# Altium schematic sheet 10_RFFE.SchDoc: RF front end
size A3; Organization: Lime Microsystems; Address1: Surrey Tech Centre; Address2: Guildford GU2 7YG; Address3: Surrey; Address4: United Kingdom; Revision: v1.0; SheetNumber: 10; SheetTotal: 12
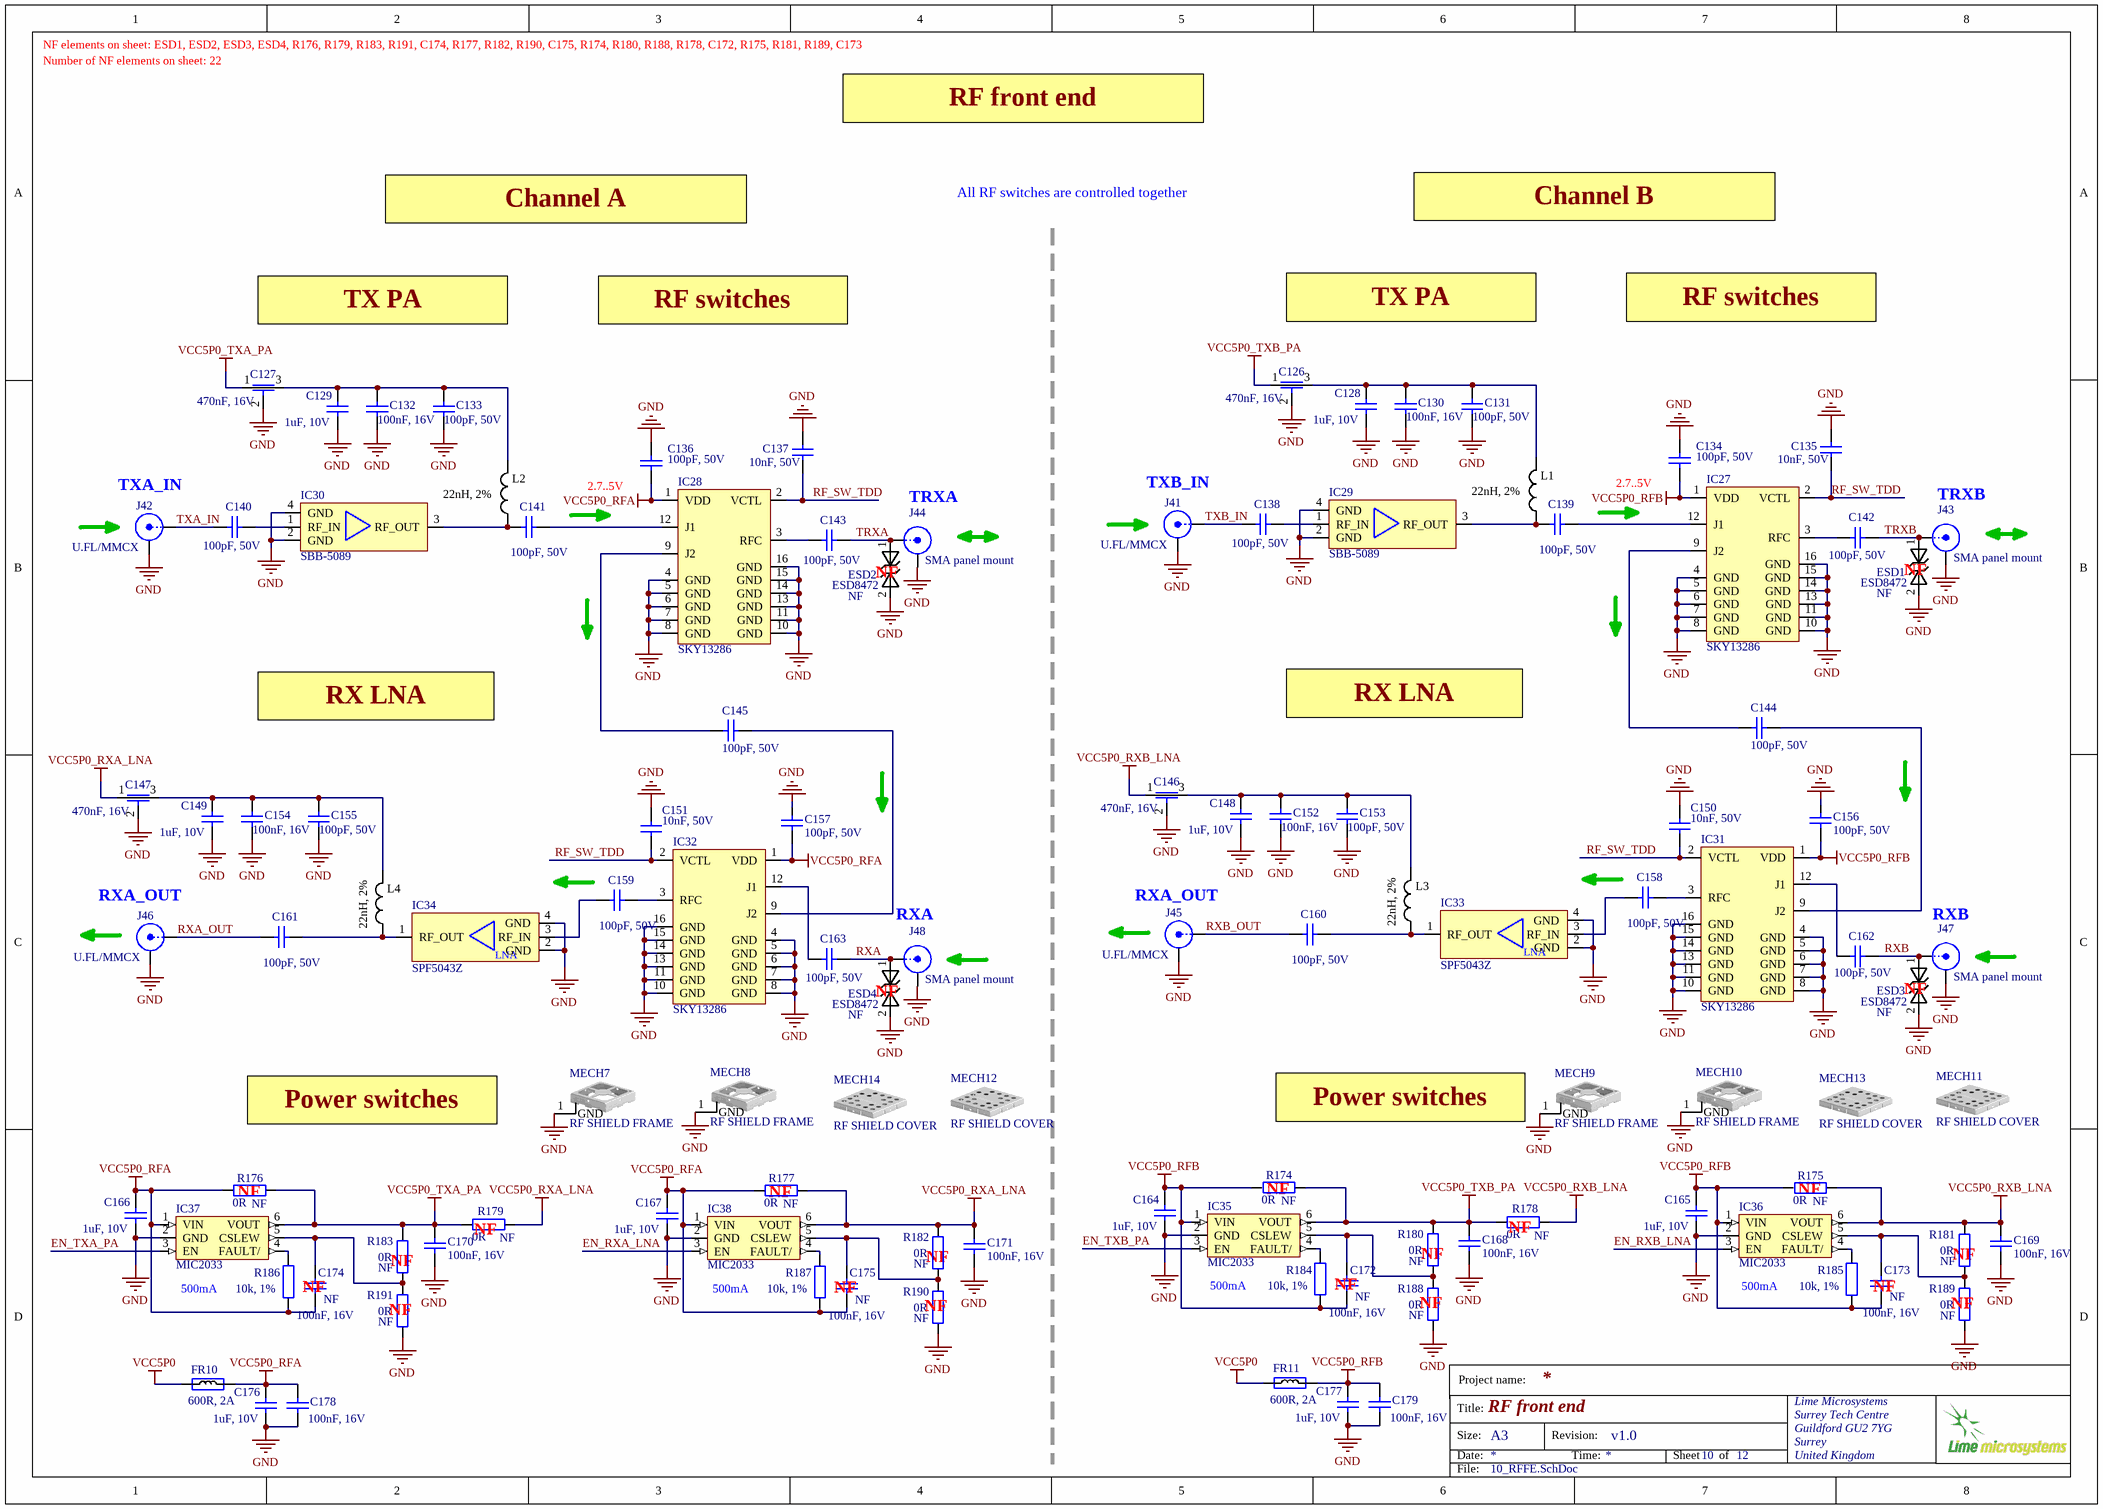
[diagram p0: 10_RFFE.SchDoc]

## Parts
C126  470nF, 16V  [CAP0805_FEEDTHROUGH]
C127  470nF, 16V  [CAP0805_FEEDTHROUGH]
C128  1uF, 10V  [CAP0402]
C129  1uF, 10V  [CAP0402]
C130  100nF, 16V  [CAP0402]
C131  100pF, 50V  [CAP0402]
C132  100nF, 16V  [CAP0402]
C133  100pF, 50V  [CAP0402]
C134  100pF, 50V  [CAP0402]
C135  10nF, 50V  [CAP0402]
C136  100pF, 50V  [CAP0402]
C137  10nF, 50V  [CAP0402]
C138  100pF, 50V  [CAP0402]
C139  100pF, 50V  [CAP0402]
C140  100pF, 50V  [CAP0402]
C141  100pF, 50V  [CAP0402]
C142  100pF, 50V  [CAP0402]
C143  100pF, 50V  [CAP0402]
C144  100pF, 50V  [CAP0402]
C145  100pF, 50V  [CAP0402]
C146  470nF, 16V  [CAP0805_FEEDTHROUGH]
C147  470nF, 16V  [CAP0805_FEEDTHROUGH]
C148  1uF, 10V  [CAP0402]
C149  1uF, 10V  [CAP0402]
C150  10nF, 50V  [CAP0402]
C151  10nF, 50V  [CAP0402]
C152  100nF, 16V  [CAP0402]
C153  100pF, 50V  [CAP0402]
C154  100nF, 16V  [CAP0402]
C155  100pF, 50V  [CAP0402]
C156  100pF, 50V  [CAP0402]
C157  100pF, 50V  [CAP0402]
C158  100pF, 50V  [CAP0402]
C159  100pF, 50V  [CAP0402]
C160  100pF, 50V  [CAP0402]
C161  100pF, 50V  [CAP0402]
C162  100pF, 50V  [CAP0402]
C163  100pF, 50V  [CAP0402]
C164  1uF, 10V  [CAP0402]
C165  1uF, 10V  [CAP0402]
C166  1uF, 10V  [CAP0402]
C167  1uF, 10V  [CAP0402]
C168  100nF, 16V  [CAP0402]
C169  100nF, 16V  [CAP0402]
C170  100nF, 16V  [CAP0402]
C171  100nF, 16V  [CAP0402]
C172  100nF, 16V  Assembly Info: NF  [CAP0402]
C173  100nF, 16V  Assembly Info: NF  [CAP0402]
C174  100nF, 16V  Assembly Info: NF  [CAP0402]
C175  100nF, 16V  Assembly Info: NF  [CAP0402]
C176  1uF, 10V  [CAP0402]
C177  1uF, 10V  [CAP0402]
C178  100nF, 16V  [CAP0402]
C179  100nF, 16V  [CAP0402]
ESD1  ESD8472  Assembly Info: NF  [ESD8472_X3DFN2]
ESD2  ESD8472  Assembly Info: NF  [ESD8472_X3DFN2]
ESD3  ESD8472  Assembly Info: NF  [ESD8472_X3DFN2]
ESD4  ESD8472  Assembly Info: NF  [ESD8472_X3DFN2]
FR10  600R, 2A  [RES0805]
FR11  600R, 2A  [RES0805]
IC27  SKY13286  [SKY13286-359LF_RF_switch_QFN16]
IC28  SKY13286  [SKY13286-359LF_RF_switch_QFN16]
IC29  SBB-5089  [SBB-5089_RF_AMP_SOT89]
IC30  SBB-5089  [SBB-5089_RF_AMP_SOT89]
IC31  SKY13286  [SKY13286-359LF_RF_switch_QFN16]
IC32  SKY13286  [SKY13286-359LF_RF_switch_QFN16]
IC33  SPF5043Z  [SPF5043Z_SOT-343]
IC34  SPF5043Z  [SPF5043Z_SOT-343]
IC35  MIC2033  [SOT23-6]
IC36  MIC2033  [SOT23-6]
IC37  MIC2033  [SOT23-6]
IC38  MIC2033  [SOT23-6]
J41  U.FL/MMCX  [MMCX_UFL_conn_u]
J42  U.FL/MMCX  [MMCX_UFL_conn_u]
J43  SMA panel mount  [SMA_connector_side]
J44  SMA panel mount  [SMA_connector_side]
J45  U.FL/MMCX  [MMCX_UFL_conn_u]
J46  U.FL/MMCX  [MMCX_UFL_conn_u]
J47  SMA panel mount  [SMA_connector_side]
J48  SMA panel mount  [SMA_connector_side]
L1  22nH, 2%  [RES0603]
L2  22nH, 2%  [RES0603]
L3  22nH, 2%  [RES0603]
L4  22nH, 2%  [RES0603]
MECH7  RF SHIELD FRAME  [RF_SHIELD_FRAME_16P5x16P5_2118716-2_v1]
MECH8  RF SHIELD FRAME  [RF_SHIELD_FRAME_16P5x16P5_2118716-2_v1]
MECH9  RF SHIELD FRAME  [RF_SHIELD_FRAME_16P5x16P5_2118716-2_v1]
MECH10  RF SHIELD FRAME  [RF_SHIELD_FRAME_16P5x16P5_2118716-2_v1]
MECH11  RF SHIELD COVER  [RF_SHIELD_COVER_16Px916P9_2118715-2]
MECH12  RF SHIELD COVER  [RF_SHIELD_COVER_16Px916P9_2118715-2]
MECH13  RF SHIELD COVER  [RF_SHIELD_COVER_16Px916P9_2118715-2]
MECH14  RF SHIELD COVER  [RF_SHIELD_COVER_16Px916P9_2118715-2]
R174  0R  Assembly Info: NF  [RES0402]
R175  0R  Assembly Info: NF  [RES0402]
R176  0R  Assembly Info: NF  [RES0402]
R177  0R  Assembly Info: NF  [RES0402]
R178  0R  Assembly Info: NF  [RES0805]
R179  0R  Assembly Info: NF  [RES0805]
R180  0R  Assembly Info: NF  [RES0402]
R181  0R  Assembly Info: NF  [RES0402]
R182  0R  Assembly Info: NF  [RES0402]
R183  0R  Assembly Info: NF  [RES0402]
R184  10k, 1%  [RES0402]
R185  10k, 1%  [RES0402]
R186  10k, 1%  [RES0402]
R187  10k, 1%  [RES0402]
R188  0R  Assembly Info: NF  [RES0402]
R189  0R  Assembly Info: NF  [RES0402]
R190  0R  Assembly Info: NF  [RES0402]
R191  0R  Assembly Info: NF  [RES0402]

## Nets
GND: C126.2 C127.2 C128.1 C129.1 C130.2 C131.1 C132.2 C133.1 C134.2 C135.1 C136.2 C137.1 C146.2 C147.2 C148.1 C149.1 C150.2 C151.2 C152.2 C153.1 C154.2 C155.1 C156.2 C157.2 C164.2 C165.2 C166.2 C167.2 C168.2 C169.2 C170.2 C171.2 C176.1 C177.1 C178.2 C179.2 ESD1.2 ESD2.2 ESD3.2 ESD4.2 IC27.4(GND) IC27.5(GND) IC27.6(GND) IC27.7(GND) IC27.8(GND) IC27.10(GND) IC27.11(GND) IC27.13(GND) IC27.14(GND) IC27.15(GND) IC27.16(GND) IC28.4(GND) IC28.5(GND) IC28.6(GND) IC28.7(GND) IC28.8(GND) IC28.10(GND) IC28.11(GND) IC28.13(GND) IC28.14(GND) IC28.15(GND) IC28.16(GND) IC29.2(GND) IC29.4(GND) IC30.2(GND) IC30.4(GND) IC31.4(GND) IC31.5(GND) IC31.6(GND) IC31.7(GND) IC31.8(GND) IC31.10(GND) IC31.11(GND) IC31.13(GND) IC31.14(GND) IC31.15(GND) IC31.16(GND) IC32.4(GND) IC32.5(GND) IC32.6(GND) IC32.7(GND) IC32.8(GND) IC32.10(GND) IC32.11(GND) IC32.13(GND) IC32.14(GND) IC32.15(GND) IC32.16(GND) IC33.2(GND) IC33.4(GND) IC34.2(GND) IC34.4(GND) IC35.2(GND) IC36.2(GND) IC37.2(GND) IC38.2(GND) J41.2(Y) J42.2(Y) J43.2(Y) J44.2(Y) J45.2(Y) J46.2(Y) J47.2(Y) J48.2(Y) MECH7.1(GND) MECH8.1(GND) MECH9.1(GND) MECH10.1(GND) R188.1 R189.1 R190.1 R191.1
VCC5P0: FR10.1 FR11.1
VCC5P0_RFA: C136.1 C157.1 C166.1 C167.1 C174.2 C175.2 C176.2 C178.1 FR10.2 IC28.1(VDD) IC32.1(VDD) IC37.1(VIN) IC38.1(VIN) R176.2 R177.2 R186.1 R187.1
VCC5P0_RFB: C134.1 C156.1 C164.1 C165.1 C172.2 C173.2 C177.2 C179.1 FR11.2 IC27.1(VDD) IC31.1(VDD) IC35.1(VIN) IC36.1(VIN) R174.2 R175.2 R184.1 R185.1
VCC5P0_RXA_LNA: C147.1 C171.1 IC38.6(VOUT) R177.1 R179.1 R182.2
VCC5P0_RXB_LNA: C146.1 C169.1 IC36.6(VOUT) R175.1 R178.1 R181.2
VCC5P0_TXA_PA: C127.1 C170.1 IC37.6(VOUT) R176.1 R179.2 R183.2
VCC5P0_TXB_PA: C126.1 C168.1 IC35.6(VOUT) R174.1 R178.2 R180.2
EN_RXA_LNA: IC38.3(EN)
EN_RXB_LNA: IC36.3(EN)
EN_TXA_PA: IC37.3(EN)
EN_TXB_PA: IC35.3(EN)
RF_SW_TDD: C135.2 C137.2 C150.1 C151.1 IC27.2(VCTL) IC28.2(VCTL) IC31.2(VCTL) IC32.2(VCTL)
RXA: C163.1 ESD4.1 J48.1(X)
RXA_OUT: C161.2 J46.1(X)
RXB: C162.1 ESD3.1 J47.1(X)
RXB_OUT: C160.2 J45.1(X)
TRXA: C143.1 ESD2.1 J44.1(X)
TRXB: C142.1 ESD1.1 J43.1(X)
TXA_IN: C140.2 J42.1(X)
TXB_IN: C138.2 J41.1(X)
NetC126_3: C126.3 C128.2 C130.1 C131.2 L1.1
NetC127_3: C127.3 C129.2 C132.1 C133.2 L2.1
NetC138_1: C138.1 IC29.1(RF_IN)
NetC139_1: C139.1 IC27.12(J1)
NetC139_2: C139.2 IC29.3(RF_OUT) L1.2
NetC140_1: C140.1 IC30.1(RF_IN)
NetC141_1: C141.1 IC28.12(J1)
NetC141_2: C141.2 IC30.3(RF_OUT) L2.2
NetC142_2: C142.2 IC27.3(RFC)
NetC143_2: C143.2 IC28.3(RFC)
NetC144_1: C144.1 IC31.9(J2)
NetC144_2: C144.2 IC27.9(J2)
NetC145_1: C145.1 IC32.9(J2)
NetC145_2: C145.2 IC28.9(J2)
NetC146_3: C146.3 C148.2 C152.1 C153.2 L3.1
NetC147_3: C147.3 C149.2 C154.1 C155.2 L4.1
NetC158_1: C158.1 IC31.3(RFC)
NetC158_2: C158.2 IC33.3(RF_IN)
NetC159_1: C159.1 IC32.3(RFC)
NetC159_2: C159.2 IC34.3(RF_IN)
NetC160_1: C160.1 IC33.1(RF_OUT) L3.2
NetC161_1: C161.1 IC34.1(RF_OUT) L4.2
NetC162_2: C162.2 IC31.12(J1)
NetC163_2: C163.2 IC32.12(J1)
NetC172_1: C172.1 IC35.5(CSLEW) R180.1 R188.2
NetC173_1: C173.1 IC36.5(CSLEW) R181.1 R189.2
NetC174_1: C174.1 IC37.5(CSLEW) R183.1 R191.2
NetC175_1: C175.1 IC38.5(CSLEW) R182.1 R190.2
NetIC35_4: IC35.4(FAULT/) R184.2
NetIC36_4: IC36.4(FAULT/) R185.2
NetIC37_4: IC37.4(FAULT/) R186.2
NetIC38_4: IC38.4(FAULT/) R187.2

## Notes on the sheet
- NF elements on sheet: ESD1, ESD2, ESD3, ESD4, R176, R179, R183, R191, C174, R177, R182, R190, C175, R174, R180, R188, R178, C172, R175, R181, R189, C173
- Number of NF elements on sheet: 22
- RF front end
- Channel A
- All RF switches are controlled together
- Channel B
- TX PA
- RF switches
- (near J42) TXA_IN
- (near C136) 2.7..5V
- TRXA
- (near J41) TXB_IN
- (near C134) 2.7..5V
- TRXB
- (near ESD2) NF
- (near ESD1) NF
- RX LNA
- (near J46) RXA_OUT
- RXA
- (near J45) RXA_OUT
- RXB
- (near ESD4) NF
- (near ESD3) NF
- Power switches
- (near MECH9) Power switches
- (near R174) NF
- (near R175) NF
- (near R176) NF
- (near R179) NF
- (near R177) NF
- (near R182) NF
- (near R180) NF
- (near R178) NF
- (near R181) NF
- (near IC37) 500mA
- NF
- (near R191) NF
- (near R183) NF
- (near IC38) 500mA
- (near R190) NF
- (near IC35) 500mA
- (near R188) NF
- (near IC36) 500mA
- (near C173) NF
- (near R189) NF
- Project name:
- Title:
- Size:
- Date:
- A3
- Revision:
- Time:
- Sheet
- of
- File:
- (in symbol SPF5043Z_RF_LNA) LNA

## Library data of the parts
C126 C127 C146 C147 = Cap_feed_through: Part Description: 0.47µF Feed Through Capacitor 16V 2A 30mOhm 0805 (2012 Metric), 3 PC Pad; Manufacturer: Murata; Manufacturer Part Number 1: NFM21PC474R1C3D; Max Current Rating: 2A; Tolerance: 20%; DC Resistance (DCR): 30mR; Insulation Resistance: 1GR; Value: 470nF, 16V; Supplier 1: Digi-Key; Supplier Part Number 1: 490-2537-1-ND; Stock 1: 220606; Pricing 1: 1=0,25000, 10=0,22900, 25=0,21840, 50=0,21160, 100=0,20450, 250=0,19392, 500=0,16218, 1000=0,12586 (USD); Mount: Surface Mount,PCB; Case/Package: 0805; Weight: 0.000194oz; Case Code (Metric): 2012; Case Code (Imperial): 0805; Min Operating Temperature: -55°C; Max Operating Temperature: 125°C; Package Quantity: 1; Capacitance: 470nF; Packaging: Tape and Reel; Max Voltage Rating (DC): 16V; Current Rating: 2A; Voltage Rating: 16V; Voltage Rating (DC): 16V; Voltage: 16V; Current: 2A; Termination: Flat; Length: 2mm; Height: 0.85mm; Width: 1.25mm; Depth: 1.25mm; Radiation Hardening: No; REACH SVHC: No SVHC; Lead Free: Lead Free; RoHS: Yes
C128 C129 C148 C149 C176 C177 = Cap_0402: CAP CER 1UF 10V X5R 0402; Manufacturer: Yageo; Part Description: 1µF 10V Ceramic Capacitor X5R 0402 (1005 Metric) 0.039" L x 0.020" W (1.00mm x 0.50mm); Manufacturer Part Number 1: CC0402MRX5R6BB105; Notification: Current market demand for these product types have resulted in fluctuating and extending lead times. Lead times may differ.; Tolerance: ±20%; Value: 1uF, 10V; Supplier 1: Digi-Key; Supplier Part Number 1: 311-1732-1-ND; RoHS: RoHS Compliant; Applications: General Purpose; Category: Capacitors; ComponentLink1Description: http://www.yageo.com/documents/recent/UPY-GPHC_X5R_4V-to-50V_25.pdf; ComponentLink1URL: http://www.yageo.com/documents/recent/UPY-GPHC_X5R_4V-to-50V_25.pdf; Failure Rate: -; Features: -; Height - Seated (Max): -; Lead Spacing: -; Lead Style: -; Mounting Type: Surface Mount, MLCC; Operating Temperature: -55°C ~ 85°C; Package / Case: 0402 (1005 Metric); Packaging: Cut Tape (CT); Part Status: Active; Pricing 1: 1=0.22, 10=0.156, 100=0.0732, 500=0.0513, 1000=0.04248, 2500=0.03953, 5000=0.03617 (USD); Ratings: -; Size / Dimension: 0.039" L x 0.020" W (1.00mm x 0.50mm); Stock 1: 69600; Temperature Coefficient: X5R; Thickness (Max): 0.022" (0.55mm); Voltage - Rated: 10V
C130 C132 C152 C154 C168-C175 = Cap_0402: Manufacturer: Murata Electronics; Manufacturer Part Number 1: GRM155R71C104KA88D; Part Description: 0.10µF ±10% 16V Ceramic Capacitor X7R 0402 (1005 Metric); Tolerance: 10 %; Type: General Purpose MLCC; Capacitance: 0.1 uF; Case Length: 1 mm; Dielectric: X7R; Case Height: 0.5 mm; Temperature Coefficient / Code: +/- 15 %; Value: 100nF, 16V; Supplier 1: Mouser; Supplier Part Number 1: 81-GRM155R71C104KA88; Case Code - in: 0402; RoHS: RoHS Compliant; Operating Temperature Range: - 55 C to + 125 C; Series: GRM; Termination Style: SMD/SMT; Package / Case: 0402 (1005 metric); Voltage Rating DC: 16 V; Maximum Operating Temperature: + 125 C; Case Code - mm: 1005; Minimum Operating Temperature: - 55 C; Product Category: Low & Medium Capacitance SMD Ceramic Chip Capacitors; Packaging: Reel; Product: General Type MLCCs; Category: Multilayer Ceramic Capacitors MLCC - SMD/SMT; Brand: Murata Electronics; Case Width: 0.5 mm; RoHS - Mouser: Y; Standard Pack Qty: 10000; Minimum Order Quantity: 1; Reeling: True; Manufacturer Part Number: GRM155R71C104KA88D
C131 C133 C134 C136 C138-C145 C153 C155-C163 = Cap_0402: Manufacturer Part Number 1: CC0402JRNPO9BN101; Manufacturer: Yageo; Part Description: 100pF ±5% 50V C0G, NP0 Ceramic Capacitor -55°C ~ 125°C Surface Mount, MLCC 0402 (1005 Metric) 0.039" L x 0.020" W (1.00mm x 0.50mm); Tolerance: ±5%; Temperature Coefficient: C0G, NP0; Value: 100pF, 50V; Capacitance: 100pF; Thickness (Max): 0.022" (0.55mm); Size / Dimension: 0.039" L x 0.020" W (1.00mm x 0.50mm); RoHS: RoHS Compliant; Ratings: -; Package / Case: 0402 (1005 Metric); Mounting Type: Surface Mount, MLCC; Height - Seated (Max): -; Features: -; Lead Spacing: -; Voltage - Rated: 50V; Operating Temperature: -55°C ~ 125°C; Packaging: Cut Tape (CT); Applications: General Purpose; Lead Style: -; Supplier 1: Digi-Key; Category: Capacitors; Supplier Part Number 1: 311-1024-1-ND
C135 C137 C150 C151 = Cap_0402: Part Description: 10000pF ±10% 50V Ceramic Capacitor X7R 0402 (1005 Metric); Manufacturer: Murata Electronics North America; Manufacturer Part Number 1: GRM155R71H103KA88D; Tolerance: ±10%; Temperature Coefficient: X7R; Value: 10nF, 50V; Supplier 1: Digi-Key; Supplier Part Number 1: 490-4516-2-ND; RoHS: RoHS Compliant; Category: Capacitors; Stock 1: 10970000; Pricing 1: 10000=0.00185, 20000=0.00176, 30000=0.00167 (USD); Packaging: Tape & Reel (TR); Part Status: Active; Voltage - Rated: 50V; Operating Temperature: -55°C ~ 125°C; Features: -; Ratings: -; Applications: General Purpose; Mounting Type: Surface Mount, MLCC; Package / Case: 0402 (1005 Metric); Size / Dimension: 0.039" L x 0.020" W (1.00mm x 0.50mm); Height - Seated (Max): -; Thickness (Max): 0.022" (0.55mm); Lead Spacing: -; Lead Style: -; ComponentLink1URL: http://www.murata.com/~/media/webrenewal/support/library/catalog/products/capacitor/mlcc/c02e.ashx?la=en-us; ComponentLink1Description: http://www.murata.com/~/media/webrenewal/support/library/catalog/products/capacitor/mlcc/c02e.ashx?la=en-us
C164-C167 = Cap_0402: Manufacturer Part Number 1: CC0402MRX5R6BB105; Manufacturer: Yageo; Part Description: 1µF 10V Ceramic Capacitor X5R 0402 (1005 Metric) 0.039" L x 0.020" W (1.00mm x 0.50mm); Voltage Rating: 10; Capacitance Tolerance: ± 10%; Product Range: TDK - C Series; Ceramic Capacitor Case: 0402 [1005 Metric]; Capacitance: 1; Dielectric Characteristic: X6; Value: 1uF, 10V; Supplier 1: Digi-Key; Supplier Part Number 1: 311-1732-1-ND; MSL: -; RoHS: YES
C178 C179 = Cap_0603: Manufacturer Part Number 1: GRM155R71C104KA88D; Part Description: 0.10µF ±10% 16V Ceramic Capacitor X7R 0402 (1005 Metric); Brand: Murata Electronics; Tolerance: 10 %; Type: General Purpose MLCC; Capacitance: 0.1 uF; Temperature Coefficient / Code: +/- 15 %; Case Height: 0.5 mm; Case Length: 1 mm; Dielectric: X7R; Supplier 1: Mouser; Supplier Part Number 1: 81-GRM155R71C104KA88; Case Code - in: 0402; Manufacturer: Murata Electronics; Category: Multilayer Ceramic Capacitors MLCC - SMD/SMT; Voltage Rating DC: 16 V; Value: 100nF, 16V; Manufacturer Part Number: GRM155R71C104KA88D; Case Code - mm: 1005; Case Width: 0.5 mm; Maximum Operating Temperature: + 125 C; Minimum Operating Temperature: - 55 C; Minimum Order Quantity: 1; Operating Temperature Range: - 55 C to + 125 C; Package / Case: 0402 (1005 metric); Packaging: Reel; Product: General Type MLCCs; Product Category: Low & Medium Capacitance SMD Ceramic Chip Capacitors; Reeling: True; RoHS - Mouser: Y; RoHS: RoHS Compliant; Series: GRM; Standard Pack Qty: 10000; Termination Style: SMD/SMT
ESD1-ESD4 = ESD8472: Manufacturer: ON Semiconductor; Manufacturer Part Number 1: ESD8472MUT5G; Part Description: TVS DIODE 5.3VWM 14VC X3DFN2; Voltage - Reverse Standoff (Typ): 5.3V (Max); Voltage - Breakdown (Min): 7V; Voltage - Clamping (Max) @ Ipp: 14V; Current - Peak Pulse (10/1000µs): 3A (8/20µs); Power Line Protection: No; Capacitance @ Frequency: 0.2pF @ 1MHz; Supplier 1: Digi-Key; RoHS: RoHS Compliant; Category: Circuit Protection; Stock 1: 2295; Pricing 1: 1=0.39, 10=0.315, 100=0.2142, 500=0.16068, 1000=0.12051 (USD); Packaging: Cut Tape (CT); Part Status: Active; Type: Zener; Power - Peak Pulse: -; Applications: Automotive, RF Antenna; Operating Temperature: -55°C ~ 150°C (TJ); Mounting Type: Surface Mount; Package / Case: 2-XFDFN; Supplier Device Package: 2-X3DFN (0.62x0.32); ComponentLink1URL: http://www.onsemi.com/pub/Collateral/ESD8472-D.PDF; ComponentLink1Description: http://www.onsemi.com/pub/Collateral/ESD8472-D.PDF; Supplier Part Number 1: ESD8472MUT5GOSCT-ND
FR10 FR11 = Ferrite: Manufacturer Part Number 1: MPZ2012S601AT000; Manufacturer: TDK Corporation; Part Description: FERRITE BEAD 600 OHM 0805 1LN; Filter Type: Differential Mode - Single; Impedance @ Frequency: 600 Ohm @ 100MHz; DC Resistance (DCR): 100 mOhm Max; Supplier 1: Digi-Key; Supplier Part Number 1: 445-2206-2-ND; Mounting Type: Surface Mount; RoHS: RoHS Compliant; Height (Max): 0.041" (1.05mm); Packaging: Tape & Reel (TR); Category: Filters; Current Rating: 2A; Package / Case: 0805 (2012 Metric); Size / Dimension: 0.079" L x 0.049" W (2.00mm x 1.25mm); Value: 600R, 2A
IC27 IC28 IC31 IC32 = SKY13286-359LF_RF_switch: Part Description: RF Switch IC GSM, ISM, PCS, WCDMA SPDT 6 GHz 50Ohm 16-QFN (4x4); Manufacturer: Skyworks Solutions; Frequency: 6GHz; Impedance: 50R; Insertion Loss: 1.8dB; Turn-Off Delay Time: 50ns; Throw Configuration: SPDT; IIP3: 46dBm; Operating Frequency: 100 MHz to 6 GHz; Number of Switches: 3; Min Supply Voltage: 2.7V; Max Supply Voltage: 5.5V; P1dB: 30dBm; Min Frequency: 100MHz; Supplier 1: Digi-Key; Supplier Part Number 1: 863-1049-1-ND; Manufacturer Part Number 1: SKY13286-359LF; Stock 1: 60609; Pricing 1: 1=3,45000, 10=3,09600, 25=2,92720, 100=2,53700, 250=2,40684, 500=2,15966, 1000=1,95150 (USD); RoHS: Yes; Mount: Surface Mount; Case/Package: QFN; Number of Pins: 16; Contact Plating: Tin,Matte; Min Operating Temperature: -40°C; Max Operating Temperature: 95°C; Package Quantity: 1; Packaging: Tape and Reel; Turn-On Delay Time: 50ns; Max Frequency: 6GHz; Series: -; Termination: SMD/SMT; Radiation Hardening: No; RoHS Compliant: Yes; REACH SVHC: Unknown; ComponentLink1URL: https://datasheet.ciiva.com/15100/getdatasheetpartid-656005-15100455.pdf?src-supplier=Verical; ComponentLink1Description: https://datasheet.ciiva.com/15100/getdatasheetpartid-656005-15100455.pdf?src-supplier=Verical; ComponentLink2URL: https://datasheet.ciiva.com/12080/200570h-20342-12080171.pdf?src-supplier=Mouser; ComponentLink2Description: https://datasheet.ciiva.com/12080/200570h-20342-12080171.pdf?src-supplier=Mouser
IC29 IC30 = SBB-5089_RF_AMP: Part Description: RF Amplifier .05-6GHz SSG 20.5dB NF 3.9dB; Manufacturer: Qorvo; Manufacturer Part Number 1: SBB5089Z; Supplier 1: Mouser; Supplier Part Number 1: 772-SBB5089Z; Stock 1: 59301; Pricing 1: 1=4,83000, 10=4,83000, 50=3,70000, 100=2,89000, 1000=2,89000, 10000=2,89000 (USD); RoHS: No
IC33 IC34 = SPF5043Z_RF_LNA: Part Description: RF Amplifier .05-4GHz SSG 12.9dB NF .8dB GaAs; Manufacturer: Qorvo; Supplier 1: Mouser; Supplier Part Number 1: 772-SPF5043Z; Manufacturer Part Number 1: SPF5043Z; Stock 1: 151851; Pricing 1: 1=3,68000, 10=3,68000, 50=2,67000, 100=2,17000, 1000=1,20000, 10000=1,06000 (USD); RoHS: Yes; RoHS Compliant: Yes
IC35-IC38 = MIC2033_power_switch: Manufacturer: Microchip; Manufacturer Part Number 1: MIC2033-05AYM6-TR; Part Description: Power Switch ICs - Power Distribution 500mA High-Side, Power Distribution Switch; Number of Outputs: 1; Interface: On/Off; Max Output Current: 500mA; Fault Protection: Over Temperature; Output Configuration: High Side; Supplier 1: Digi-Key; Supplier Part Number 1: 576-4143-1-ND; Stock 1: 1966; Pricing 1: 1=0,80000, 25=0,65720, 100=0,61500 (USD); RoHS: Yes; Mount: Surface Mount; Case/Package: SOT-23-6; Number of Pins: 6; Min Operating Temperature: -40°C; Max Operating Temperature: 125°C; Packaging: Tape and Reel; Package Quantity: 3000; Series: -; Number of Switches: 1; RoHS Compliant: Yes; ComponentLink1URL: http://www.mouser.com/ds/2/268/mic2033-b-1076865.pdf?src-supplier=Mouser; ComponentLink1Description: http://www.mouser.com/ds/2/268/mic2033-b-1076865.pdf?src-supplier=Mouser; ComponentLink2URL: http://components.arrow.com/part/dataview/56727820S413982N1374?src-supplier=Arrow+Electronics; ComponentLink2Description: http://components.arrow.com/part/dataview/56727820S413982N1374?src-supplier=Arrow+Electronics; ComponentLink3URL: http://www.microchip.com/mymicrochip/filehandler.aspx?ddocname=en579457&src-supplier=Digi-Key; ComponentLink3Description: http://www.microchip.com/mymicrochip/filehandler.aspx?ddocname=en579457&src-supplier=Digi-Key
J41 J42 J45 J46 = RF_IF_connector: CONN UMC RCPT STR 50 OHM SMD; Manufacturer: Molex, LLC; Manufacturer Part Number 1: 0734120110; Body Finish: Nickel; Body Material: Phosphor Bronze; Center Contact Material: Brass; Center Contact Plating: Gold; Connector Style: Ultra Miniature Coaxial; Connector Type: Jack, Male Pin; Contact Termination: Solder; Dielectric Material: Liquid Crystal Polymer (LCP); Frequency - Max: 6GHz; Impedance: 50 Ohm; Voltage Rating: 60V; Cable Group: -; Category: Connectors, Interconnects; Fastening Type: Snap-On; Features: -; Housing Color: Silver; Ingress Protection: -; Mounting Type: Surface Mount; Operating Temperature: -40°C ~ 90°C; Packaging: Cut Tape (CT); RoHS: RoHS Compliant; Shield Termination: Solder; Supplier 1: Digi-Key; Supplier Part Number 1: WM5587CT-ND; Part Description: CONN UMC RCPT STR 50 OHM SMD
J43 J44 J47 J48 = RF_IF_connector: CONN SMA JACK STR 50OHM EDGE MNT; Manufacturer: Linx; Manufacturer Part Number 1: CONSMA002-L-G; Part Description: SMA Connector Receptacle, Female Socket 50Ohm Panel Mount, Through Hole, Right Angle Solder; Supplier 1: Digi-Key; Supplier Part Number 1: CONSMA002-L-G-ND; Stock 1: 815; Pricing 1: 1=4.08, 25=3.67, 100=3.32, 250=3.25, 500=3, 1000=2.80001, 2000=2.5875 (USD)
L1-L4 = Inductor: Manufacturer: Murata; Manufacturer Part Number 1: LQW18AN22NG00D; Part Description: Fixed Inductors 22 NH 2%; Core Material: Non-Magnetic; Self Resonant Frequency: 4.6GHz; Shielding: Unshielded; Q Factor: 40; Current Rating: 500mA; DC Resistance (DCR): 170mR; Test Frequency: 100MHz; Current: 400mA; Value: 22nH, 2%; ComponentLink1URL: http://productfinder.pulseeng.com/products/datasheets/WC701.pdf; ComponentLink1Description: http://productfinder.pulseeng.com/products/datasheets/WC701.pdf; Parameter 1: *; Supplier 1: Digi-Key; Supplier Part Number 1: 490-6874-1-ND; Stock 1: 60315; Pricing 1: 1=0,18000, 10=0,16300, 25=0,14520, 50=0,12340, 100=0,10890, 250=0,09984, 500=0,09076, 1000=0,07623 (USD); RoHS: Yes; Mount: Surface Mount; Case/Package: 0603; Number of Pins: 2; Weight: 0.000106oz; Case Code (Metric): 1608; Case Code (Imperial): 0603; Min Operating Temperature: -55°C; Max Operating Temperature: 125°C; Tolerance: 2%; Inductance Tolerance: 2%; Packaging: Tape and Reel; Package Quantity: 4000; Inductance: 22nH; Max DC Current: 500mA; Termination: SMD/SMT; Resistor Type: Wirewound; DC Current: 500mA; Series Resistance: 170mR; Series: LQW18A_00; Rated Current-Max: 500mA; Length: 1.6mm; Width: 0.8mm; Height: 0.8mm; Height - Seated (Max): 0.039inch; Depth: 1mm; REACH SVHC: No SVHC; Military Standard: Not; Lead Free: Lead Free; RoHS Compliant: Yes; ComponentLink2URL: https://datasheet.ciiva.com/11799/0900766b80a002db-11799279.pdf?src-supplier=RSComponents; ComponentLink2Description: https://datasheet.ciiva.com/11799/0900766b80a002db-11799279.pdf?src-supplier=RSComponents; ComponentLink3URL: https://datasheet.ciiva.com/14124/qhlqw18a-data-e-14124619.pdf?src-supplier=Distrelec; ComponentLink3Description: https://datasheet.ciiva.com/14124/qhlqw18a-data-e-14124619.pdf?src-supplier=Distrelec; ComponentLink4URL: https://datasheet.ciiva.com/6705/l0075s0080lqw18a-00-6705627.pdf?src-supplier=Digi-Key; ComponentLink4Description: https://datasheet.ciiva.com/6705/l0075s0080lqw18a-00-6705627.pdf?src-supplier=Digi-Key; ComponentLink5URL: https://datasheet.ciiva.com/6705/l0075s0080lqw18a-00-6705626.pdf?src-supplier=Digi-Key; ComponentLink5Description: https://datasheet.ciiva.com/6705/l0075s0080lqw18a-00-6705626.pdf?src-supplier=Digi-Key; ComponentLink6URL: https://datasheet.ciiva.com/6705/l0075s0080lqw18a-00-6705631.pdf?src-supplier=Digi-Key; ComponentLink6Description: https://datasheet.ciiva.com/6705/l0075s0080lqw18a-00-6705631.pdf?src-supplier=Digi-Key; ComponentLink7URL: https://datasheet.ciiva.com/4977/product-4977173.pdf?src-supplier=Mouser; ComponentLink7Description: https://datasheet.ciiva.com/4977/product-4977173.pdf?src-supplier=Mouser; ComponentLink8URL: https://datasheet.ciiva.com/46391/1487239-46391853.pdf?src-supplier=Element14; ComponentLink8Description: https://datasheet.ciiva.com/46391/1487239-46391853.pdf?src-supplier=Element14; ComponentLink9URL: https://datasheet.ciiva.com/8507/l0075s0080lqw18a-00-8507496.pdf?src-supplier=Avnet; ComponentLink9Description: https://datasheet.ciiva.com/8507/l0075s0080lqw18a-00-8507496.pdf?src-supplier=Avnet
MECH7-MECH10 = RF_SHIELD_FRAME_16P5x16P5_2118716-2: Part Description: RF Shield Frame 0.650" (16.50mm) X 0.650" (16.50mm) Surface Mount; Manufacturer: TE Connectivity; Supplier 1: Digi-Key; Supplier Part Number 1: A126152CT-ND; Manufacturer Part Number 1: 2118716-2; Stock 1: 26553; Pricing 1: 1=0,93000, 10=0,81600, 25=0,76680, 100=0,62570, 250=0,58120 (USD); RoHS: Yes; ComponentLink1URL: https://www.te.com/commerce/DocumentDelivery/DDEController?Action=srchrtrv&DocNm=2118716&DocType=Customer+Drawing&DocLang=English&src-supplier=Digi-Key; ComponentLink1Description: https://www.te.com/commerce/DocumentDelivery/DDEController?Action=srchrtrv&DocNm=2118716&DocType=Customer+Drawing&DocLang=English&src-supplier=Digi-Key
MECH11-MECH14 = RF_SHIELD_COVER_16P9x16P9_2118715-2: Part Description: RF Shield Cover 0.665" (16.90mm) X 0.665" (16.90mm) Vented Surface Mount; Manufacturer: TE Connectivity; ComponentLink1URL: https://www.te.com/commerce/DocumentDelivery/DDEController?Action=srchrtrv&DocNm=2118716&DocType=Customer+Drawing&DocLang=English&src-supplier=Digi-Key; ComponentLink1Description: https://www.te.com/commerce/DocumentDelivery/DDEController?Action=srchrtrv&DocNm=2118716&DocType=Customer+Drawing&DocLang=English&src-supplier=Digi-Key; Supplier 1: Digi-Key; Supplier Part Number 1: A126120-ND; Manufacturer Part Number 1: 2118715-2; Stock 1: 58094; Pricing 1: 1=1,44000, 10=1,28900, 25=1,22400, 100=1,00530, 250=0,93972, 500=0,83046, 1000=0,65562, 2500=0,61191, 5000=0,58132 (USD); RoHS: Yes; ComponentLink2URL: https://www.te.com/commerce/DocumentDelivery/DDEController?Action=srchrtrv&DocNm=2118715&DocType=Customer+Drawing&DocLang=English&src-supplier=Digi-Key; ComponentLink2Description: https://www.te.com/commerce/DocumentDelivery/DDEController?Action=srchrtrv&DocNm=2118715&DocType=Customer+Drawing&DocLang=English&src-supplier=Digi-Key
R174-R177 R180-R183 R188-R191 = Res_0402: Manufacturer Part Number 1: RC0402JR-070RL; Manufacturer: Yageo; Part Description: RES SMD 0.0OHM JUMPER 1/16W 0402; Resistance (Ohms): 0.0; Tolerance: Jumper; Power (Watts): 0.063W, 1/16W; Value: 0R; Supplier 1: Digi-Key; Supplier Part Number 1: 311-0.0JRTR-ND; Category: Resistors; Temperature Coefficient: -; Features: Moisture Resistant; Supplier Device Package: 0402; Height: 0.016" (0.40mm); Package / Case: 0402 (1005 Metric); Operating Temperature: -55°C ~ 155°C; Size / Dimension: 0.039" L x 0.020" W (1.00mm x 0.50mm); Composition: Thick Film; Packaging: Tape & Reel (TR); Number of Terminations: 2; RoHS: RoHS Compliant
R178 R179 = Res_0402: Manufacturer Part Number 1: CRCW08050000Z0EA; Manufacturer: Vishay Dale; Part Description: RES SMD 0.0 OHM JUMPER 1/8W 0805; Power (Watts): 0.125W, 1/8W; Resistance (Ohms): 0.0; Tolerance: Jumper; Value: 0R; Supplier 1: Digi-Key; Supplier Part Number 1: 541-0.0ATR-ND; Package / Case: 0805 (2012 Metric); Height: 0.020" (0.50mm); Packaging: Tape & Reel (TR); Operating Temperature: -55°C ~ 155°C; Temperature Coefficient: -; RoHS: RoHS Compliant; Size / Dimension: 0.079" L x 0.049" W (2.00mm x 1.25mm); Supplier Device Package: 0805 (2012 Metric); Number of Terminations: 2; Category: Resistors; Features: Automotive AEC-Q200; Composition: Thick Film
R184-R187 = Res_0402: Manufacturer: Yageo; Manufacturer Part Number 1: RC0402FR-0710KL; Part Description: RES SMD 10K OHM 1% 1/16W 0402; Temperature Coefficient: ±100ppm/°C; Power (Watts): 0.063W, 1/16W; Value: 10k, 1%; Supplier 1: Digi-Key; Supplier Part Number 1: 311-10.0KLRTR-ND; Resistance (Ohms): 10k; Packaging: Tape & Reel (TR); RoHS: RoHS Compliant; Package / Case: 0402 (1005 Metric); Tolerance: ±1%; Operating Temperature: -55°C ~ 155°C; Size / Dimension: 0.039" L x 0.020" W (1.00mm x 0.50mm); Number of Terminations: 2; Category: Resistors; Height: 0.016" (0.40mm); Supplier Device Package: 0402; Features: Moisture Resistant; Composition: Thick Film